# EAGLE design Grove - NFC v1 (EAGLE 6.4)
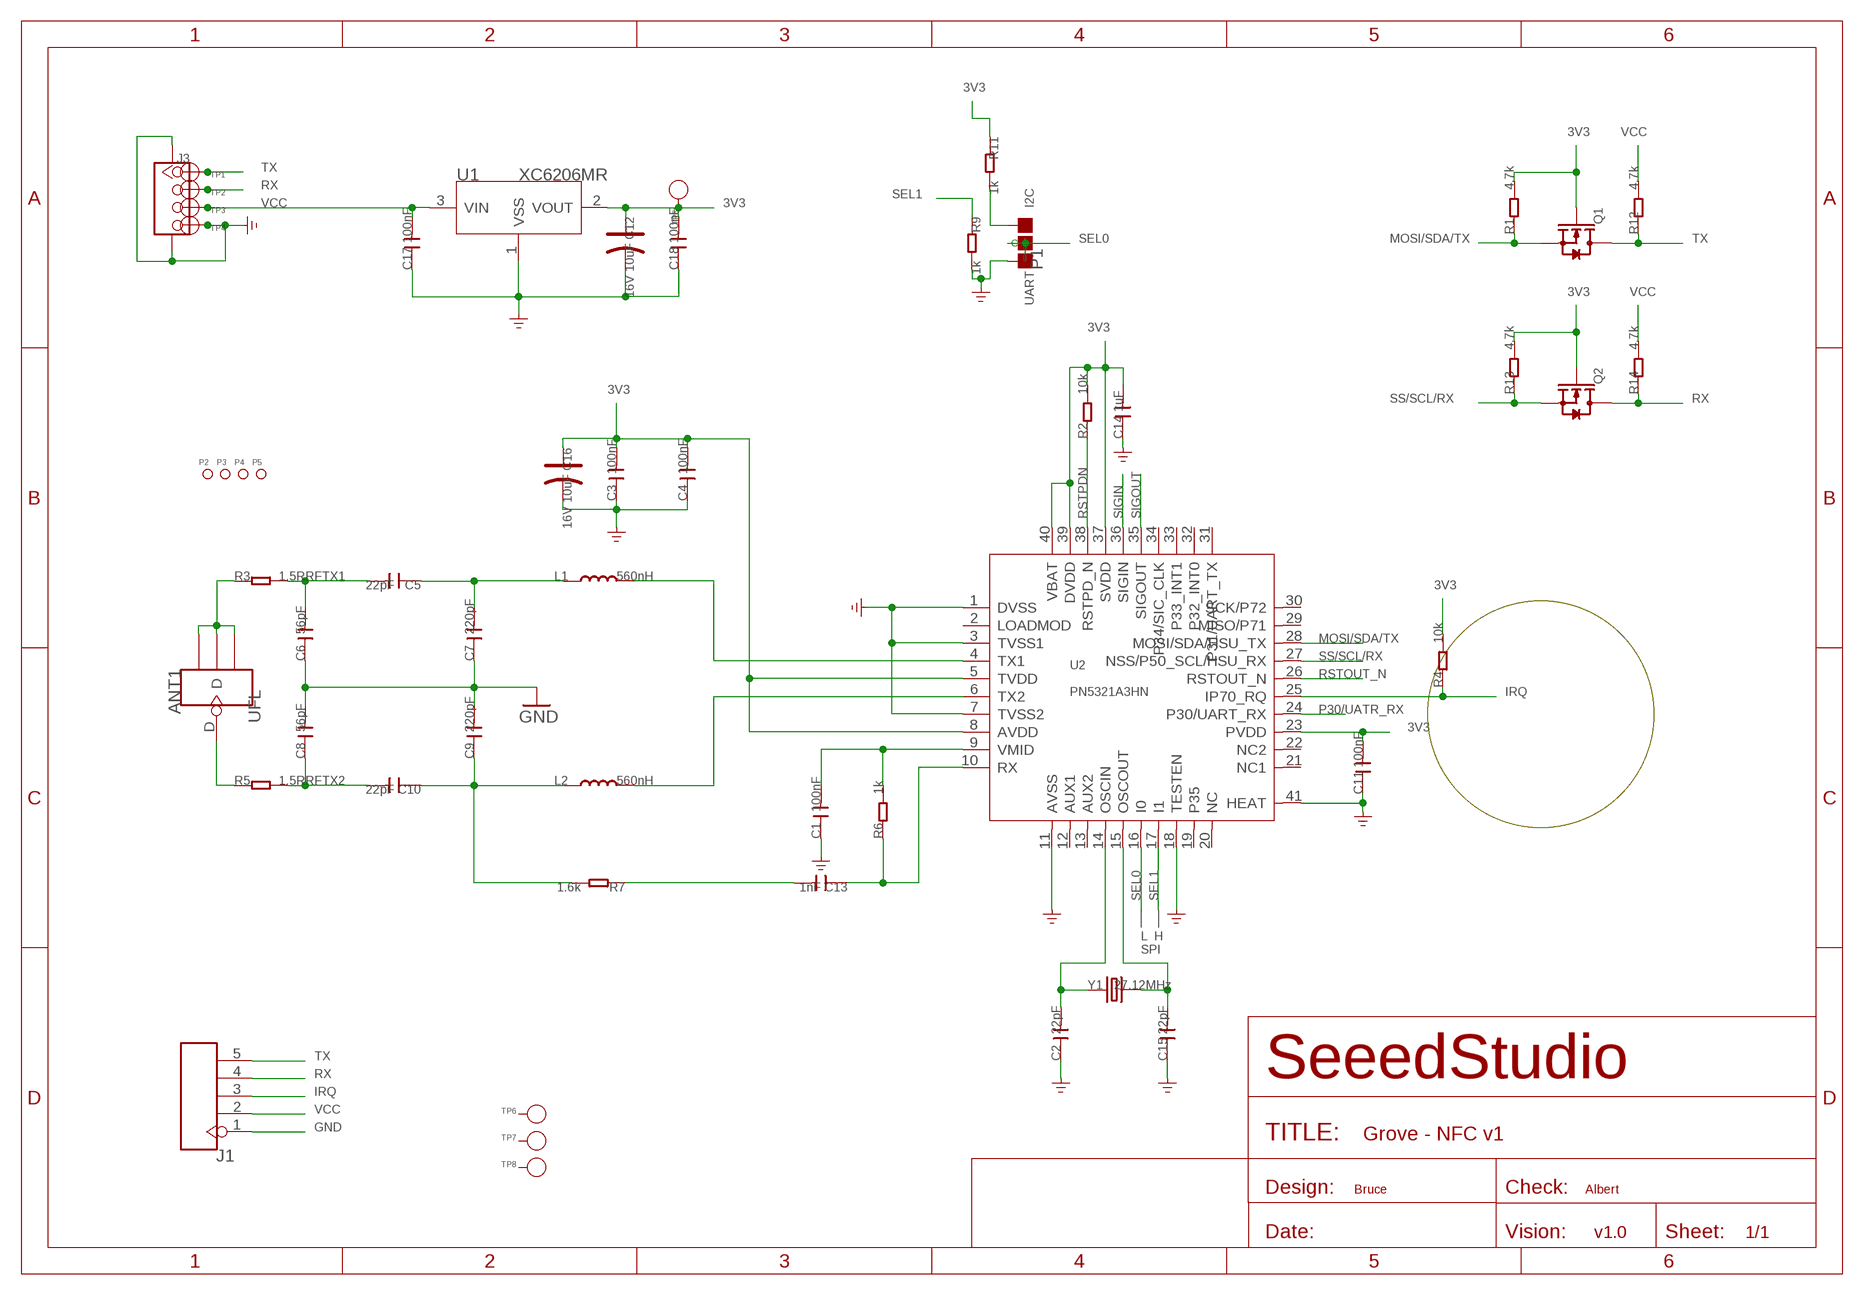
[diagram p0: schematic, sheet 1]

## Parts
ANT1  UFL  ANTENNA-U-FL  [4P-U-FL]
C1  100nF  C-0402  [C0402]
C2  22pF  C-0402  [C0402]
C3  100nF  C-0402  [C0402]
C4  100nF  C-0402  [C0402]
C5  22pF  C-0402  [C0402]
C6  56pF  C-0402  [C0402]
C7  220pF  C-0402  [C0402]
C8  56pF  C-0402  [C0402]
C9  220pF  C-0402  [C0402]
C10  22pF  C-0402  [C0402]
C11  100nF  C-0402  [C0402]
C12  16V 10uF  CAP-AVX-A  [AVX-A]
C13  1nF  C-0402  [C0402]
C14  1uF  C-0603  [C0603]
C15  22pF  C-0402  [C0402]
C16  16V 10uF  CAP-AVX-A  [AVX-A]
C17  100nF  C-0402  [C0402]
C18  100nF  C-0402  [C0402]
J1  HEADER-5P-2.54  [5P-2.54]
J3  TWIG-4P-2.0-SMD-FEMALE-REINFORCE'90D'  [4P-SMD-2.0-90D]
L1  560nH  L'0603'  [L0603]
L2  560nH  L'0603'  [L0603]
P1  PAD-JUMPER-3P-40*40  [3P-SMD-4.1X1.5]
P2  PAD-MARK  [ROUND-MARK-1.0]
P3  PAD-MARK  [ROUND-MARK-1.0]
P4  PAD-MARK  [ROUND-MARK-1.0]
P5  PAD-MARK  [ROUND-MARK-1.0]
Q1  MOSFET-N'SOT23'  [SOT23]
Q2  MOSFET-N'SOT23'  [SOT23]
R1  4.7k  R-0402  [R0402]
R2  10k  R-0402  [R0402]
R3  1.5R  R-0402  [R0402]
R4  10k  R-0402  [R0402]
R5  1.5R  R-0402  [R0402]
R6  1k  R-0402  [R0402]
R7  1.6k  R-0402  [R0402]
R9  1k  R-0402  [R0402]
R11  1k  R-0402  [R0402]
R12  4.7k  R-0402  [R0402]
R13  4.7k  R-0402  [R0402]
R14  4.7k  R-0402  [R0402]
TP1  PAD-TEST-POINT'4545'  [TP_4545]
TP2  PAD-TEST-POINT'4545'  [TP_4545]
TP3  PAD-TEST-POINT'4545'  [TP_4545]
TP4  PAD-TEST-POINT'4545'  [TP_4545]
TP5  PAD-TEST-POINT'4545'  [TP_4545]
TP6  PAD-TEST-POINT'4545'  [TP_4545]
TP7  PAD-TEST-POINT'4545'  [TP_4545]
TP8  PAD-TEST-POINT'4545'  [TP_4545]
U1  XC6206MR  [SOT23]
U2  PN5321A3HN  PN532-HVQFN40  [HVQFN40]
Y1  27.12MHz  CRYSTAL'3225'  [4P-SMD-3.2X2.5]

## Nets
3V3: C3.2 C4.2 C11.2 C12.+ C14.2 C16.+ C18.2 Q1.1(G) Q2.1(G) R1.2 R2.2 R4.2 R11.1 R13.2 TP5.T U1.2(VOUT) U2.5(TVDD) U2.8(AVDD) U2.23(PVDD) U2.37(SVDD) U2.39(DVDD) U2.40(VBAT)
GND: C1.1 C2.1 C3.1 C4.1 C6.1 C7.1 C8.2 C9.2 C11.1 C12.- C14.1 C15.1 C16.- C17.1 C18.1 J1.1 J3.4 J3.SS1 J3.SS2 P1.11(R) R9.2 TP4.T U1.1(VSS) U2.1(DVSS) U2.3(TVSS1) U2.7(TVSS2) U2.11(AVSS) U2.18(TESTEN) U2.41(HEAT)
IRQ: J1.3 R4.1 U2.25(IP70_RQ)
MOSI/SDA/TX: Q1.2(S) R1.1 U2.28(MOSI/SDA/HSU_TX)
N$1: C2.2 U2.14(OSCIN) Y1.2
N$2: C15.2 U2.15(OSCOUT) Y1.4
N$3: L2.2 U2.6(TX2)
N$4: L1.2 U2.4(TX1)
N$5: C5.1 C7.2 L1.1
N$6: C13.2 R7.1
N$7: C9.1 C10.1 L2.1 R7.2
N$8: ANT1.GND1 ANT1.GND2 ANT1.GND3 R3.1
N$9: C1.2 R6.2 U2.9(VMID)
N$10: P1.00(L) R11.2
N$11: C13.1 R6.1 U2.10(RX)
N$17: ANT1.D R5.1
P30/UATR_RX: U2.24(P30/UART_RX)
RFTX1: C5.2 C6.2 R3.2
RFTX2: C8.1 C10.2 R5.2
RSTOUT_N: U2.26(RSTOUT_N)
RSTPDN: R2.1 U2.38(RSTPD_N)
RX: J1.4 J3.2 Q2.3(D) R14.1 TP2.T
SEL0: P1.MM(C) U2.16(I0)
SEL1: R9.1 U2.17(I1)
SIGIN: U2.36(SIGIN)
SIGOUT: U2.35(SIGOUT)
SS/SCL/RX: Q2.2(S) R13.1 U2.27(NSS/P50_SCL/HSU_RX)
TX: J1.5 J3.1 Q1.3(D) R12.1 TP1.T
VCC: C17.2 J1.2 J3.3 R12.2 R14.2 TP3.T U1.3(VIN)
Unconnected: TP6.T TP7.T TP8.T U2.2(LOADMOD) U2.12(AUX1) U2.13(AUX2) U2.19(P35) U2.20(NC) U2.21(NC1) U2.22(NC2) U2.29(MISO/P71) U2.30(SCK/P72) U2.31(P31/UART_TX) U2.32(P32_INT0) U2.33(P33_INT1) U2.34(P34/SIC_CLK)

## Notes on the sheet
- I2C
- UART
- L | H
- SPI
- Bruce | Albert
- v1.0

## Library data of the parts
ANT1 = Connector:ANTENNA-U-FL
C1-C11 C13-C15 C17 C18 = Discrete:C*: Ceramic Capacitors
C12 C16 = Discrete:CAP*: Electrolytic Capacitors,Tantalum Capacitors and Super Capacitors
J1 = Connector :HEADER-5P
J3 = Connector :TWIG-4P-2.0-SMD-FEMALE-REINFORCE
L1 L2 = Discrete:L*
P1 = Discrete:PAD-JUMPER-3P; PARTNO: DNP
P2-P5 = Discrete:PAD-MARK; PARTNO: DNP
Q1 Q2 = Discrete:MOSFET-N: IRLL014: http://www.vishay.com/docs/91319/sihll014.pdf
R1-R7 R9 R11-R14 = Discrete:R*
TP1-TP8 = Discrete:PAD-TEST-POINT; PARTNO: DNP
U1 = IC:XC6206: LOW ESR Cap.Compatible Positive Voltage Regulators
U2 = IC:PN532: NFC Controller http://www.adafruit.com/datasheets/pn532ds.pdf
Y1 = Discrete:CRYSTAL*: CRYSTAL

## Net classes
0 default: width 0.152 mm, drill 0.305 mm, clearance 0.152 mm
1 GND: width 0.152 mm, drill 0.305 mm, clearance 0.152 mm to class 0, clearance 0.152 mm
3 usbvcc: width 0.203 mm, drill 0.305 mm, clearance 0.203 mm

## Board
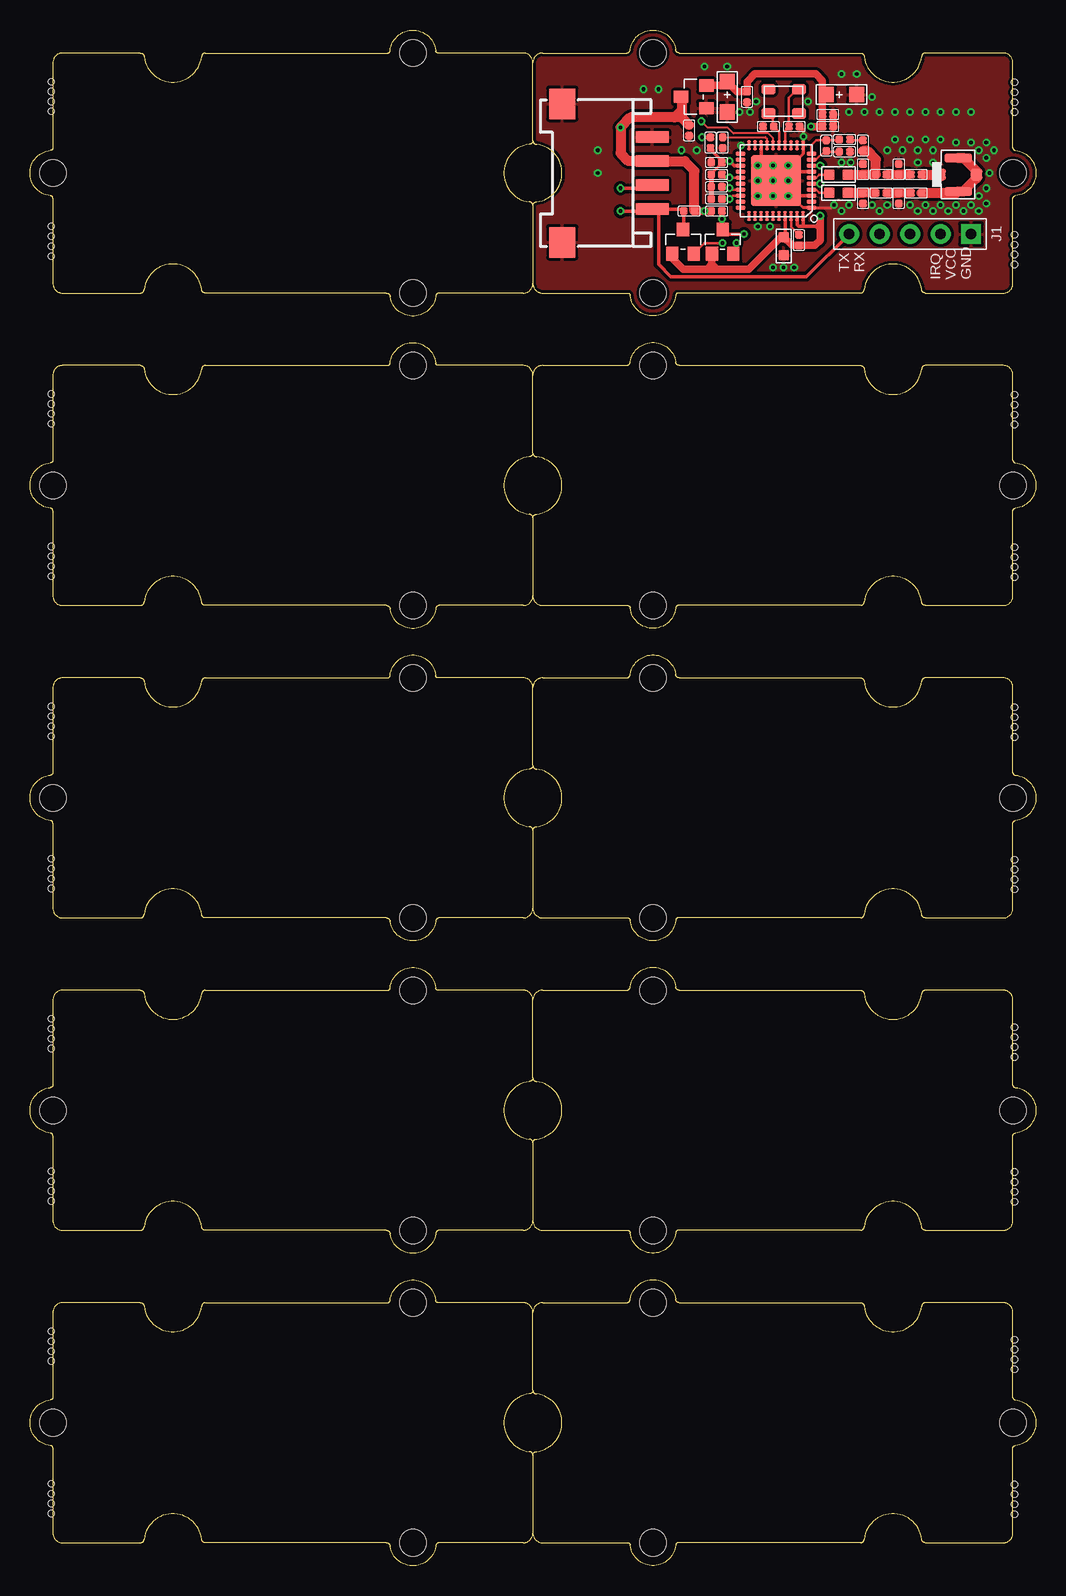
[diagram p1: board, top side]
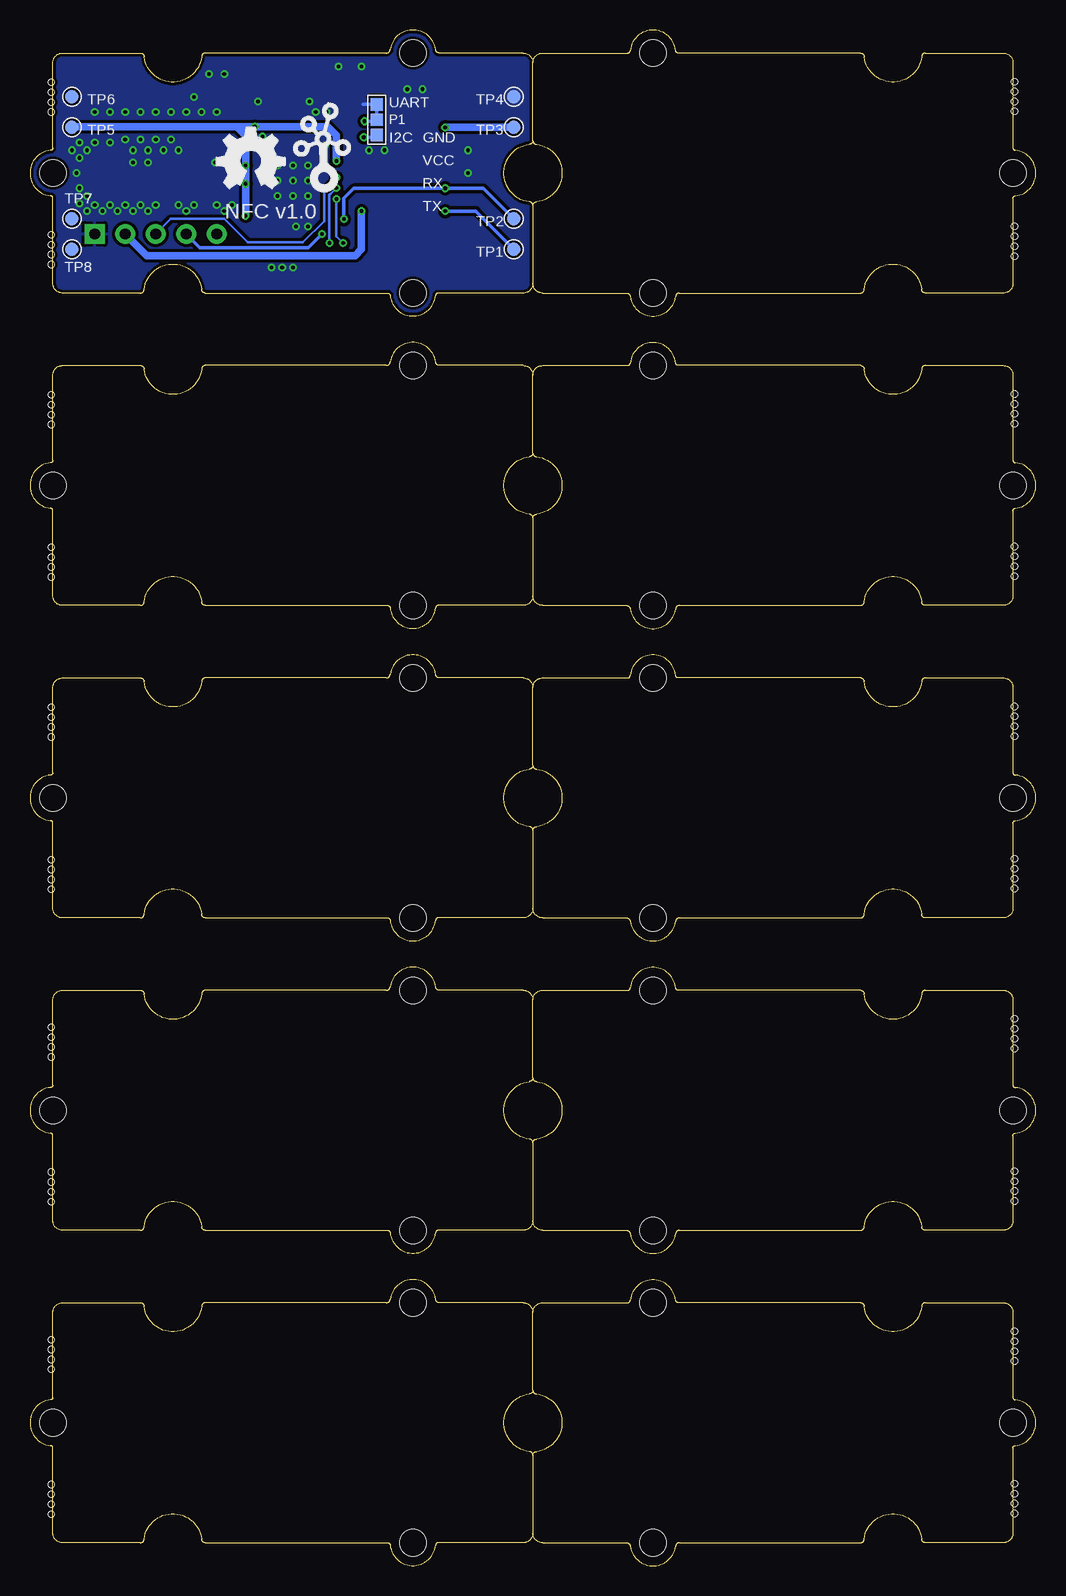
[diagram p2: board, bottom side, seen from below]

Size 83.82 x 127.98 mm. Coordinates in mm from the lower left corner, seen from the top.
Copper layers (1*16): Top 0.035mm / dielectric 1.5mm / Bottom 0.035mm
Design rules "SeeedStudio_DRU_no_angle_20130527 *": minimum track width 6mil, minimum drill 12mil, track to track 6mil, track to pad 6mil, pad to pad 6mil, via to via 6mil, smd to smd 0mil, copper to edge 10mil, drill to drill 10mil, minimum pad ring 10mil, minimum via ring 6mil, stop-mask expansion 2mil, vias tented up to drill 25mil, thermal gap 10mil
Holes 0.5 mm at 1.78,32.88 1.78,30.4 1.78,31.23 1.78,32.05 1.78,45.58 1.78,43.1 1.78,43.93 1.78,44.75 1.78,58.91 1.78,56.43 1.78,57.26 1.78,58.09 1.78,71.61 1.78,69.13 1.78,69.96 1.78,70.79 1.78,84.95 1.78,82.47 1.78,83.3 1.78,84.12 1.78,97.65 1.78,95.17 1.78,96 1.78,96.82 1.78,111.62 1.78,109.14 1.78,109.97 1.78,110.79 1.78,123.68 1.78,121.2 1.78,122.03 1.78,122.86 82.04,121.14 82.04,123.62 82.04,122.79 82.04,121.97 82.04,108.44 82.04,110.92 82.04,110.09 82.04,109.27 82.04,95.11 82.04,97.58 82.04,96.76 82.04,95.93 82.04,82.41 82.04,84.88 82.04,84.06 82.04,83.23 82.04,69.07 82.04,71.55 82.04,70.72 82.04,69.9 82.04,56.37 82.04,58.85 82.04,58.02 82.04,57.2 82.04,42.4 82.04,44.88 82.04,44.05 82.04,43.23 82.04,30.34 82.04,32.81 82.04,31.99 82.04,31.16 1.78,6.84 1.78,4.36 1.78,5.19 1.78,6.02 1.78,19.54 1.78,17.06 1.78,17.89 1.78,18.72 82.04,16.37 82.04,18.84 82.04,18.02 82.04,17.19 82.04,4.3 82.04,6.78 82.04,5.95 82.04,5.13
Holes 1.91 mm at -4.13,2.4 87.95,2.4 87.95,125.59 -4.13,125.59

### Footprints (pad centres in the part's own frame; a part is rotated, then mirrored left to right if it is on the bottom)
4P-U-FL = smd 1.016 x 1.016: D -1.524,0; GND3 1.524,0 | smd 2.286 x 0.762: GND1 0,1.397; GND2 0,-1.397
C0402 = smd 0.635 x 0.635: 1 -0.445,0; 2 0.445,0
AVX-A = smd 1.27 x 1.27: + -1.27,0; - 1.27,0
C0603 = smd 0.889 x 0.889: 1 -0.762,0; 2 0.762,0
5P-2.54 = drill 0.889 pad 1.651 square: 1 0,5.08 | drill 0.889 pad 1.651: 2 0,2.54; 3 0,0; 4 0,-2.54; 5 0,-5.08
4P-SMD-2.0-90D = smd 0.965 x 2.74: 1 -3,-0.1; 2 -1,-0.1; 3 1,-0.1; 4 3,-0.1 | smd 2.54 x 2.184: SS1 -5.771,7.4; SS2 5.771,7.4
L0603 = smd 0.889 x 0.889: 1 -0.762,0; 2 0.762,0
3P-SMD-4.1X1.5 = smd 1.016 x 1.016: 00 -1.27,0; 11 1.27,0; MM 0,0
ROUND-MARK-1.0 = smd 1.016 x 1.016: P$1 0,0
SOT23 = smd 1.016 x 1.143: 1 -0.889,-1.016; 2 0.889,-1.016; 3 0,1.016
R0402 = smd 0.635 x 0.635: 1 -0.445,0; 2 0.445,0
TP_4545 = smd 1.143 x 1.143: T 0,0
SOT23' = smd 1.016 x 1.2: 1 -0.95,-1.06; 2 0.95,-1.06; 3 0,1.06
HVQFN40 = smd 0.8 x 0.3: 1 -2.95,2.25; 2 -2.95,1.75; 3 -2.95,1.25; 4 -2.95,0.75; 5 -2.95,0.25; 6 -2.95,-0.25; 7 -2.95,-0.75; 8 -2.95,-1.25; 9 -2.95,-1.75; 10 -2.95,-2.25; 21 2.95,-2.25; 22 2.95,-1.75; 23 2.95,-1.25; 24 2.95,-0.75; 25 2.95,-0.25; 26 2.95,0.25; 27 2.95,0.75; 28 2.95,1.25; 29 2.95,1.75; 30 2.95,2.25 | smd 0.3 x 0.8: 11 -2.25,-2.95; 12 -1.75,-2.95; 13 -1.25,-2.95; 14 -0.75,-2.95; 15 -0.25,-2.95; 16 0.25,-2.95; 17 0.75,-2.95; 18 1.25,-2.95; 19 1.75,-2.95; 20 2.25,-2.95; 31 2.25,2.95; 32 1.75,2.95; 33 1.25,2.95; 34 0.75,2.95; 35 0.25,2.95; 36 -0.25,2.95; 37 -0.75,2.95; 38 -1.25,2.95; 39 -1.75,2.95; 40 -2.25,2.95 | smd 4.2 x 4.2: 41 0,0
GROVE-TEST-PLATFORM = hole 2.2: -10,-10; -10,10; 20,0
4P-SMD-3.2X2.5 = smd 1.143 x 0.889: 1 -1.27,1.016; 2 -1.27,-1.016; 3 1.27,-1.016; 4 1.27,1.016

### Placement (x,y rotation side)
ANT1  77.34,115.93 0 top
C1  67.88,117.84 180 top
C2  63.69,119.93 180 top
C3  66.49,119.93 180 top
C4  66.49,120.95 180 top
C5  70.93,114.41 0 top
C6  72.39,113.97 90 top
C7  69.41,113.97 90 top
C8  72.39,116.38 90 top
C9  69.41,116.38 90 top
C10  70.93,115.93 0 top
C11  57.21,116.95 0 top
C12  58.1,122.41 270 top
C13  67.88,118.86 0 top
C14  62.8,109.97 90 top
C15  61.53,119.93 0 top
C16  67.63,122.6 0 top
C17  54.93,119.62 90 top
C18  59.75,122.41 90 top
J1  73.34,110.98 270 top
J3  51.75,116.06 90 top
L1  67.37,114.41 180 top
L2  67.37,115.93 180 top
P1  54.93,120.51 90 bottom
P2  87.95,120.51 0 top  (outside the outline)
P3  -4.13,120.51 0 top  (outside the outline)
P4  87.95,7.48 0 top  (outside the outline)
P5  -4.13,7.48 0 top  (outside the outline)
Q1  54.42,110.35 0 top
Q2  57.72,110.35 0 top
R1  57.21,113.9 180 top
R2  64.07,110.47 270 top
R3  73.85,114.41 180 top
R4  57.21,115.93 180 top
R5  73.85,115.93 180 top
R6  66.36,118.35 270 top
R7  69.41,118.35 270 top
R9  57.72,118.6 270 top
R11  56.71,118.6 90 top
R12  54.93,112.89 0 top
R13  57.21,114.92 180 top
R14  57.21,112.89 180 top
TP1  43.5,109.71 0 bottom
TP2  43.5,112.25 0 bottom
TP3  43.5,119.87 0 bottom
TP4  43.5,122.41 0 bottom
TP5  80.33,119.87 0 bottom
TP6  80.33,122.41 0 bottom
TP7  80.33,112.25 0 bottom
TP8  80.33,109.71 0 bottom
U1  XC6206MR  [SOT23']  55.31,122.41 90 top
U2  62.17,115.43 180 top
U$2  [GROVE-TEST-PLATFORM]  61.91,116.06 0 top
U$3  [OSHW_FILLX200_NOTEXT]  68.26,114.79 0 bottom
U$4  [TWIGLOGO]  59.37,115.43 0 bottom
U$5  [GROVE-TEST-PLATFORM]  21.91,116.06 180 top
U$6  [GROVE-TEST-PLATFORM]  21.91,90.03 180 top
U$7  [GROVE-TEST-PLATFORM]  61.91,90.03 0 top
U$8  [GROVE-TEST-PLATFORM]  21.91,63.99 180 top
U$9  [GROVE-TEST-PLATFORM]  61.91,63.99 0 top
U$10  [GROVE-TEST-PLATFORM]  21.91,37.96 180 top
U$11  [GROVE-TEST-PLATFORM]  61.91,37.96 0 top
U$12  [GROVE-TEST-PLATFORM]  21.91,11.92 180 top
U$13  [GROVE-TEST-PLATFORM]  61.91,11.92 0 top
Y1  62.8,122.03 180 top

### Tracks (layer width: path | path; a pad name or v marks a point on that pad's centre or on a via)
3V3  (via drill 0.3 pad 0.64)
  Top 0.254: 57.66,116.89 56.77,116
  Top 0.305: U2.8 65.83,116.68 v65.85,116.7 | 57.68,116.93 C11.2 | C14.2 62.92,110.84 U2.37 | U2.5 v65.85,115.18 v65.85,115.17 | U2.39 63.92,111.77 64.07,111.62 64.26,111.62 | U2.40 64.42,111.78 | 64.42,111.77 64.42,111.65 64.45,111.62 | 64.42,111.78 64.58,111.62 | 64.42,111.78 64.42,111.77 | 64.42,111.77 64.26,111.62 | 64.26,111.62 64.45,111.62 | 64.45,111.62 64.58,111.62 | C11.2 57.66,117.01 | C11.2 57.66,116.89 | R4.2 56.77,116 | R11.1 56.71,118.03 57.66,117.08 C11.2 | 64.58,111.62 65.47,111.62 | 65.47,111.62 65.72,111.62 65.85,111.74 | 65.47,111.62 65.72,111.87 | 65.47,111.62 65.85,111.24 | U2.23 58.69,116.68 v58.29,117.08 57.79,117.08 C11.2
  Top 0.406: R4.2 R13.2 R1.2
  Top 0.61: U1.2 57.78,123.36 C12.+ 58.93,122.86 C18.2 59.75,123.68 60.39,124.32 65.47,124.32 66.04,123.75 66.04,122.28 | v65.85,112.51 65.85,111.74 65.85,111.24 65.85,110.47 65.41,110.03 R2.2 63.5,110.03 C14.2 62.55,110.73 59.88,108.06 57.21,108.06 | v65.09,119.93 C3.2 C4.2 66.04,122.28 | 66.04,122.28 C16.+ | Q1.1 53.53,108.95 54.42,108.06 56.45,108.06 | 57.21,108.06 56.96,108.06 | Q2.1 56.83,108.44 | 56.83,108.44 56.83,108.19 56.96,108.06 | 56.83,108.44 57.21,108.06 | 56.83,108.44 56.45,108.06 | 56.45,108.06 56.96,108.06
  Bottom 0.61: v65.85,112.51 v65.85,115.17 v65.85,116.7 65.85,119.17 | 65.85,119.17 v65.09,119.93 | v65.09,119.93 59.02,119.93 58.29,119.21 v58.29,117.08 | v65.09,119.93 80.27,119.93 TP5.T | 65.85,119.17 65.85,119.24 | 65.85,119.24 65.85,119.74 65.98,119.87 | 65.85,119.24 65.91,119.24 66.55,119.87
GND  (via drill 0.3 pad 0.64)
  Top 0.203: v63.18,114.16 63.31,114.28
  Top 0.254: v63.18,114.16 63.82,113.52 64.07,113.52 64.42,113.18 U2.1 66.78,113.18 v66.99,113.39 | U2.11 64.42,117.68 63.82,117.08 63.56,117.08 v63.18,116.7
  Top 0.305: U2.18 60.92,116.68 U2.41 | U2.7 62.92,116.18 U2.41 | U2.41 63.31,114.28 63.42,114.18 U2.3 | U2.11 64.42,119.65 C2.1 | J3.SS1 44.3,110.35
  Top 0.61: C3.1 C4.1 | 43.63,110.35 44.3,110.35
  Bottom 0.305: P1.11 56.05,121.78
  other vias: 61.91,116.7 60.64,116.7 63.18,115.43 61.91,115.43 60.64,115.43 60.64,114.16 61.91,114.16 68.26,121.14 69.53,121.14 67.63,124.32 68.9,124.32 70.17,122.41 71.44,117.97 72.71,117.97 73.98,117.97 75.25,117.97 73.98,116.95 75.25,116.95 68.26,113.39 70.17,113.39 71.44,113.39 73.34,113.39 74.61,113.39 75.88,113.39 68.39,116.95 67.63,116.95 59.25,118.35 60.52,122.03 60.01,121.14 51.12,123.05 52.39,123.05 67.63,112.89 70.8,112.89 73.98,112.89 75.25,112.89 72.07,118.86 73.34,118.86 74.61,118.86 75.88,118.86 77.15,113.39 78.42,113.39 79.06,114.16 79.69,114.79 79.69,117.33 79.06,117.97 78.42,118.6 77.15,118.6 79.95,116.06 76.52,112.89 77.79,112.89 79.06,112.89 79.69,113.52 79.69,118.6 80.33,117.97 64.83,122.03 60.64,111.62 61.66,111.62 47.31,117.97 47.31,116.06 70.8,121.14 72.07,121.14 73.34,121.14 74.61,121.14 75.88,121.14 77.15,121.14 78.42,121.14 55.56,117.97 54.29,117.97 59.12,121.14 58.1,124.95 56.2,124.95 64.45,119.11 62.8,108.19 63.69,108.19 61.91,108.19
  pour Top (isolate 0.254, rank 6): 41.59,128.13 84.14,128.13 84.14,105.27 84.14,104 41.59,104
  pour Bottom (isolate 0.254, rank 6): 41.59,128.13 84.14,128.13 84.14,105.27 84.14,104 41.59,104
IRQ  (via drill 0.3 pad 0.64)
  Top 0.203: R4.1 57.92,115.68 v58.29,115.68 U2.25
  Bottom 0.203: J1.3 72.07,112.25 67.63,112.25 65.67,110.29 61.08,110.29 59.31,112.06 59.31,114.66 59.06,114.91 v58.29,115.68
MOSI/SDA/TX  (via drill 0.3 pad 0.64)
  Top 0.203: 59.23,114.18 U2.28 58.57,114.18 v58.29,113.9 R1.1 | v57.72,110.22 56.2,110.22 Q1.2
  Bottom 0.203: v58.29,113.9 58.29,110.79 v57.72,110.22
N$1
  Top 0.203: U2.14 62.92,119.39 62.92,119.54 62.92,119.61 C2.2 63.25,122.35 63.95,123.05 Y1.2
N$2
  Top 0.203: U2.15 62.42,119.28 62.42,119.43 62.42,119.49 C15.2 61.91,119.93 61.91,121.01 Y1.4
N$3
  Top 0.203: U2.6 65.53,115.68 65.79,115.93 L2.2
N$4
  Top 0.203: U2.4 65.52,114.68 65.79,114.41 L1.2
N$5
  Top 0.61: C5.1 70.3,114.41
  Top 0.813: L1.1 C7.2 70.3,114.41
N$6
  Top 0.203: R7.1 68.39,118.79 C13.2
N$7
  Top 0.61: C10.1 70.3,115.93
  Top 0.813: L2.1 C9.1 70.3,115.93 | C10.1 70.49,117.18 69.76,117.9 R7.2
N$8
  Top 0.813: R3.1 77.22,114.41 ANT1.GND2 77.79,114.54 78.87,115.62 ANT1.GND3 78.87,116.25 77.79,117.33 ANT1.GND1
N$9
  Top 0.203: C1.2 66.42,117.84 R6.2 66.36,117.84 66.17,117.84 65.53,117.2 65.09,117.2 U2.9
N$10  (via drill 0.3 pad 0.64)
  Top 0.305: R11.2 v56.01,119.05
  Bottom 0.305: v56.01,119.05 55.12,119.05 P1.00
N$11
  Top 0.203: C13.1 67.37,118.79 R6.1 65.53,118.79 65.12,118.38 U2.10
N$17
  Top 0.61: R5.1 74.49,115.93
  Top 0.813: 74.49,115.93 ANT1.D
RFTX1
  Top 0.61: C5.2 71.57,114.41 | R3.2 73.22,114.41
  Top 0.813: 71.57,114.41 C6.2 73.22,114.41
RFTX2
  Top 0.61: R5.2 73.22,115.93 | C10.2 71.57,115.93
  Top 0.813: 73.22,115.93 C8.1 71.57,115.93
RSTPDN
  Top 0.203: U2.38 63.42,111.57 R2.1
RX  (via drill 0.3 pad 0.64)
  Top 0.305: 52.75,115.06 J3.2 51.58,114.79 v49.21,114.79 | R14.1 v57.66,112.22 57.66,111.43 Q2.3 58.1,110.98 v59.5,110.98
  Bottom 0.305: TP2.T 46.04,114.79 v49.21,114.79 56.83,114.79 57.66,113.97 v57.66,112.22 | J1.4 69.66,109.84 60.64,109.84 v59.5,110.98
SEL0  (via drill 0.3 pad 0.64)
  Top 0.152: U2.16 61.92,118.98 61.53,119.36 58.61,119.36 58.1,119.87 56.45,119.87 v55.94,120.38
  Bottom 0.305: 54.93,121.78 P1.MM 55.06,120.38 v55.94,120.38
SEL1
  Top 0.152: R9.1 61.28,119.05 61.42,118.91 U2.17
SS/SCL/RX  (via drill 0.3 pad 0.64)
  Top 0.203: U2.27 58.43,114.68 v58.3,114.8 57.77,114.8 R13.1 | v58.87,110.22 58.87,109.58 Q2.2
  Bottom 0.203: v58.87,110.22 58.87,114.24 58.75,114.35 v58.3,114.8
TX  (via drill 0.3 pad 0.64)
  Top 0.305: J1.5 64.71,107.43 53.4,107.43 52.39,108.44 52.39,113.06 | v49.21,112.89 51.68,112.89 J3.1 52.39,113.06 | 52.39,113.06 54.31,113.06 R12.1 54.48,111.43 Q1.3
  Bottom 0.305: TP1.T 46.67,112.89 v49.21,112.89
VCC  (via drill 0.3 pad 0.64)
  Top 0.61: 54.29,122.37 U1.3 | R14.2 v56.2,112.89 R12.2
  Top 0.813: 54.29,120.7 53.72,120.7 | 53.72,120.7 50.04,120.7 v49.21,119.87 49.21,117.71 49.86,117.06 J3.3 54.56,117.06 55.37,116.25 R12.2 | 54.29,122.37 54.29,120.7 | 54.29,120.7 C17.2 | 53.72,120.7 54.17,121.14
  Bottom 0.61: TP3.T v49.21,119.87 | J1.2 74.08,109.18 56.73,109.18 56.2,109.71 56.2,112.38 v56.2,112.89

### Text on the board
tPlace: TX | RX | IRQ | VCC | GND
bPlace: UART | GND | I2C | VCC | RX | TX | NFC v1.0